# EAGLE design main_module (EAGLE 7.7.0)
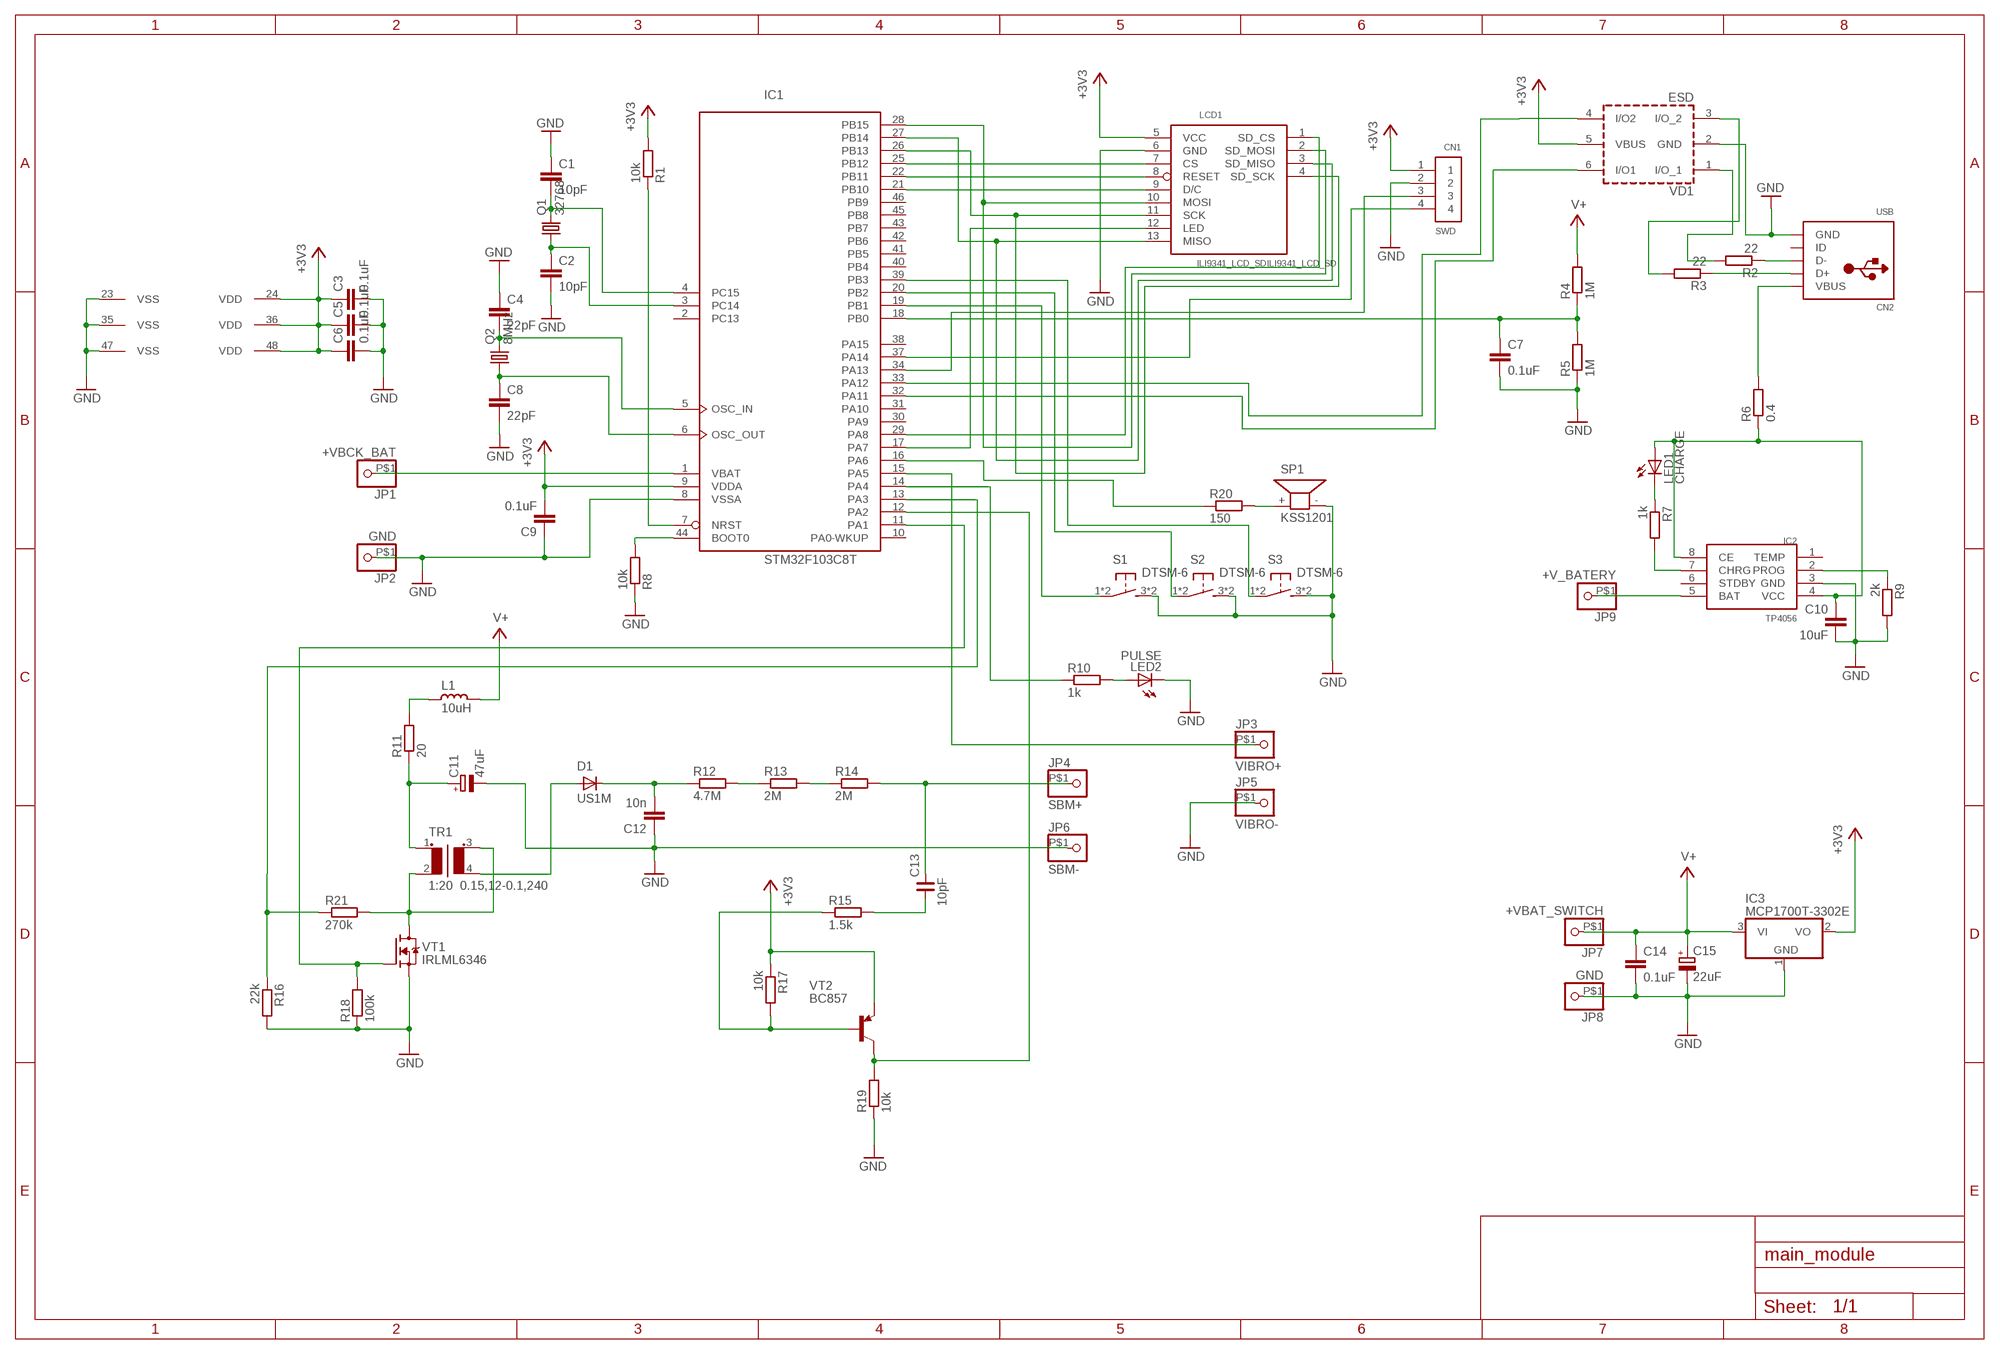
[diagram p0: schematic, sheet 1]

## Parts
C1  10pF  C-EUC0805  [C0805]
C2  10pF  C-EUC0805  [C0805]
C3  0.1uF  C-EUC0805  [C0805]
C4  22pF  C-EUC0805  [C0805]
C5  0.1uF  C-EUC0805  [C0805]
C6  0.1uF  C-EUC0805  [C0805]
C7  0.1uF  C-EUC0805  [C0805]
C8  22pF  C-EUC0805  [C0805]
C9  0.1uF  C-EUC0805  [C0805]
C10  10uF  C-EUC0805  [C0805]
C11  47uF  CPOL-EUC/6032-28R  [C/6032-28R]
C12  10n  C-EUC1206  [C1206]
C13  10pF  C_1206  [C1206]
C14  0.1uF  C-EUC0805  [C0805]
C15  22uF  CPOL-EUC/6032-28R  [C/6032-28R]
CN1  SWD  1X4-BIG  [1X04-BIG]
CN2  USB  USBMINIB  [USB-MINIB]
D1  US1M  GF1  [SMA-DO214AC]
IC1  STM32F103C8T  [LQFP48]
IC2  TP4056  [SOP-8]
IC3  MCP1700T-3302E  MCP1703CB  [SOT23]
JP1  +VBCK_BAT  PINHD-1X1-BIGPOGO  [1X1-BIGPOGO]
JP2  GND  PINHD-1X1-BIGPOGO  [1X1-BIGPOGO]
JP3  VIBRO+  PINHD-1X1-BIGPOGO  [1X1-BIGPOGO]
JP4  SBM+  PINHD-1X1-BIGPOGO  [1X1-BIGPOGO]
JP5  VIBRO-  PINHD-1X1-BIGPOGO  [1X1-BIGPOGO]
JP6  SBM-  PINHD-1X1-BIGPOGO  [1X1-BIGPOGO]
JP7  +VBAT_SWITCH  PINHD-1X1-BIGPOGO  [1X1-BIGPOGO]
JP8  GND  PINHD-1X1-BIGPOGO  [1X1-BIGPOGO]
JP9  +V_BATERY  PINHD-1X1-BIGPOGO  [1X1-BIGPOGO]
L1  10uH  L_0805  [L0805]
LCD1  ILI9341_LCD_SDILI9341_LCD_SD  [ILI9341_LCD_SD]
LED1  CHARGE  LEDCHIP-LED0805  [CHIP-LED0805]
LED2  PULSE  LED3MM  [LED3MM]
Q1  32768  CRYSTALHC49S  [HC49/S]
Q2  8MHz  CRYSTALHC49S  [HC49/S]
R1  10k  R-EU_M0805  [M0805]
R2  22  R-EU_M0805  [M0805]
R3  22  R-EU_M0805  [M0805]
R4  1M  R-EU_M0805  [M0805]
R5  1M  R-EU_M0805  [M0805]
R6  0.4  R-EU_M1206  [M1206]
R7  1k  R-EU_M0805  [M0805]
R8  10k  R-EU_M0805  [M0805]
R9  2k  R-EU_M0805  [M0805]
R10  1k  R-EU_M0805  [M0805]
R11  20  R-EU_M0805  [M0805]
R12  4.7M  R-EU_M0805  [M0805]
R13  2M  R-EU_M0805  [M0805]
R14  2M  R-EU_M0805  [M0805]
R15  1.5k  R-EU_M0805  [M0805]
R16  22k  R-EU_M0805  [M0805]
R17  10k  R-EU_M0805  [M0805]
R18  100k  R-EU_M0805  [M0805]
R19  10k  R-EU_M0805  [M0805]
R20  150  R-EU_M0805  [M0805]
R21  270k  R-EU_M0805  [M0805]
S1  DTSM-6  [DTSM-6]
S2  DTSM-6  [DTSM-6]
S3  DTSM-6  [DTSM-6]
SP1  KSS1201  [KSS1201]
TR1  1:20 0.15,12-0.1,240  RING-TRANS  [RING-TRANS]
VD1  ESD  USBLC6-2SC6  [SOT-23-6L]
VT1  IRLML6346  MOSFET-N-SOT23  [SOT23]
VT2  BC857  -PNP-SOT23-BCE  [SOT23-BCE]

## Nets
32OSC_IN: C1.2 IC1.4(PC15) Q1.2
32OSC_OUT: C2.1 IC1.3(PC14) Q1.1
+3V3 [power]: C3.1 C5.1 C6.1 C9.2 CN1.1 IC1.9(VDDA) IC1.24(VDD) IC1.36(VDD) IC1.48(VDD) IC3.2(VO) LCD1.5(VCC) R1.2 R17.1 VD1.5(VBUS) VT2.E
+V_BATTERY: IC2.5(BAT) JP9.P$1
+VBCK_BAT: IC1.1(VBAT) JP1.P$1
BATT_CTRL: C7.1 IC1.18(PB0) R4.1 R5.2
GND [power]: C1.1 C2.2 C3.2 C4.1 C5.2 C6.2 C7.2 C8.2 C9.1 C10.2 C11.- C12.1 C14.2 C15.- CN1.2 CN2.GND IC1.8(VSSA) IC1.23(VSS) IC1.35(VSS) IC1.47(VSS) IC2.3(GND) IC3.1(GND) JP2.P$1 JP5.P$1 JP6.P$1 JP8.P$1 LCD1.6(GND) LED2.K(C) R5.1 R8.1 R9.2 R16.2 R18.1 R19.1 S1.3 S1.4 S2.3 S2.4 S3.3 S3.4 SP1.- VD1.2(GND) VT1.2(S)
HV_OUT: C12.2 D1.K(C) R12.1
HV_PULSE: IC1.12(PA2) R19.2 VT2.C
HV_PUMP: IC1.11(PA1) R18.2 VT1.1(G)
HV_TEST: IC1.13(PA3) R16.1 R21.1
HV_TR_OUT: D1.A TR1.4(S2)
KEY1: IC1.19(PB1) S1.1 S1.2
KEY2: IC1.20(PB2) S2.1 S2.2
KEY3: IC1.39(PB3) S3.1 S3.2
LCD_BACKLIGHT: IC1.17(PA7) LCD1.12(LED)
LCD_CS: IC1.25(PB12) LCD1.7(CS)
LCD_RESET: IC1.22(PB11) LCD1.8(RESET)
LCD_RS: IC1.21(PB10) LCD1.9(D/C)
LED_PULSE: IC1.14(PA4) R10.1
MISO: IC1.27(PB14) LCD1.3(SD_MISO) LCD1.13(MISO)
MOSI: IC1.28(PB15) LCD1.2(SD_MOSI) LCD1.10(MOSI)
N$2: R13.2 R14.1
N$3: R20.2 SP1.+
N$6: R12.2 R13.1
N$7: IC1.7(NRST) R1.1
N$8: L1.2 R11.2
N$9: C13.1 R15.2
N$10: C10.1 IC2.4(VCC) IC2.8(CE) LED1.A R6.1
N$11: LED2.A R10.2
N$13: R15.1 R17.2 VT2.B
N$16: C11.+ R11.1 TR1.1
N$18: IC1.44(BOOT0) R8.2
N$19: CN2.D- R2.1
N$20: CN2.D+ R3.1
N$21: IC2.2(PROG) R9.1
N$22: R21.2 TR1.2 TR1.3(S1) VT1.3(D)
N$24: IC2.7(CHRG) R7.2
N$25: LED1.C R7.1
OSC_IN: C4.2 IC1.5(OSC_IN) Q2.2
OSC_OUT: C8.1 IC1.6(OSC_OUT) Q2.1
SBM+: C13.2 JP4.P$1 R14.2
SCK: IC1.26(PB13) LCD1.4(SD_SCK) LCD1.11(SCK)
SD_CS: IC1.29(PA8) LCD1.1(SD_CS)
SOUND: IC1.16(PA6) R20.1
SWCLK: CN1.4 IC1.37(PA14)
SWDIO: CN1.3 IC1.34(PA13)
USB_DM: IC1.32(PA11) VD1.6(I/O1)
USB_DM_PROT: R2.2 VD1.1(I/O_1)
USB_DP: IC1.33(PA12) VD1.4(I/O2)
USB_DP_PROT: R3.2 VD1.3(I/O_2)
USB_POWER [power]: CN2.VBUS R6.2
V+ [power]: C14.1 C15.+ IC3.3(VI) JP7.P$1 L1.1 R4.2
VIBRO: IC1.15(PA5) JP3.P$1
Unconnected: CN2.ID IC1.2(PC13) IC1.10(PA0-WKUP) IC1.30(PA9) IC1.31(PA10) IC1.38(PA15) IC1.40(PB4) IC1.41(PB5) IC1.42(PB6) IC1.43(PB7) IC1.45(PB8) IC1.46(PB9) IC2.1(TEMP) IC2.6(STDBY)

## Library data of the parts
C1-C10 C12 C14 = resistor:C-EU: CAPACITOR, European symbol
C11 C15 = resistor:CPOL-EU: POLARIZED CAPACITOR, European symbol
C13 = rc-master-smd:C_: NON-POLARIZED CAP
CN1 = adafruit:1X4: 4-pin connector
CN2 = adafruit:USB: USB Connectors USBMINIB - Surface Mount Female Mini-B USB Connector 4UConnector: 06564 By microbuilder.eu Thru-hole RA Female Mini-B USB Connector 4UConnector: 18732 By ladyada.net
D1 = diode:GF1: DIODE
IC1 = micro-stm_v3:STM32F103C*T: ARM 32-bit Cortex™-M3 CPU 72 MHz maximum frequency 16 to 128 Kbytes of Flash memory 6 to 20 kbytes of SRAM 37 GPIOs 2.0 to 3.6 V application supply
IC2 = TP4056:TP4056
IC3 = linear:MCP1703: 250 mA, 16V, Low Quiescent Current LDO Regulator Source: http://ww1.microchip.com/downloads/en/DeviceDoc/22049b.pdf
JP1-JP9 = adafruit:PINHD-1X1: Pin header 1x1 for 0.1" spacing With round pins
L1 = rc-master-smd:L_: INDUCTOR
LCD1 = ili9341:ILI9341_LCD_SD: ILI9341 2.2" LCD board with SD-Card holder
LED1 = led:LED: LED
LED2 = adafruit:LED: LED
Q1 Q2 = crystal:CRYSTAL: CRYSTAL; OC_FARNELL: 1667008; OC_NEWARK: unknown
R1-R21 = resistor:R-EU_: RESISTOR, European symbol
S1-S3 = switch-tact:DTSM-6
SP1 = buzzer:KSS1201: SPEAKER Source: Schukat; OC_FARNELL: unknown; OC_NEWARK: unknown
TR1 = transformer-pulse:RING-TRANS: TRANSFORMERS FOR DIGITAL AUDIO DATA TRANSMISSION Source: Data sheet <http://ww2.pulseeng.com/products/datasheets/T601.pdf> www.pulseeng.com
VD1 = usblc6:USBLC6-2: VERY LOW CAPACITANCE ESD PROTECTION 2 line Datasheet link <http://www.st.com/web/catalog/sense_power/FM114/CL1137/SC1489/PF93353>
VT1 = we-transistor:MOSFET-N: N-Channel MOSFET TSM3404, IRLML2502 (Vgs>=+/-20V, Vds>=20V, Id>=3A + Rds<=0.05Ohm @ Vgs=4.5V) BSS138 (Vgs>=+/-20V, Vds>=40V, Id>=0.2A + Rds<=3Ohm @ Vgs=4.5V)
VT2 = transistor:*-PNP-: PNP Transistror

## Net classes
0 default: clearance 0.152 mm
1 power: width 0.508 mm, clearance 0.152 mm to class 0, clearance 0.152 mm

## Board
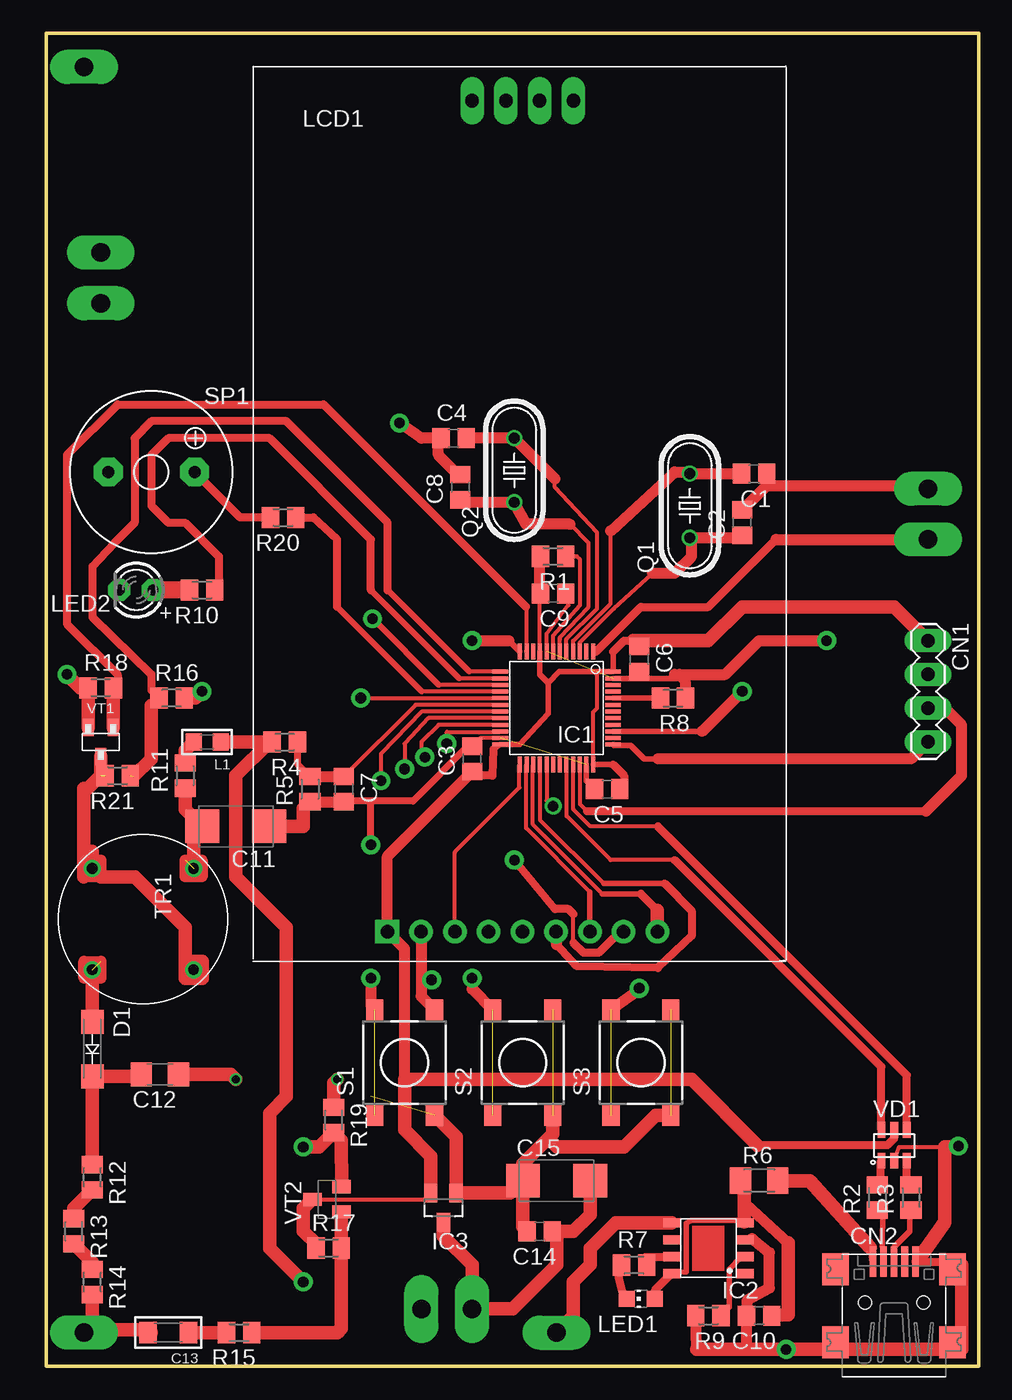
[diagram p1: board, top side]
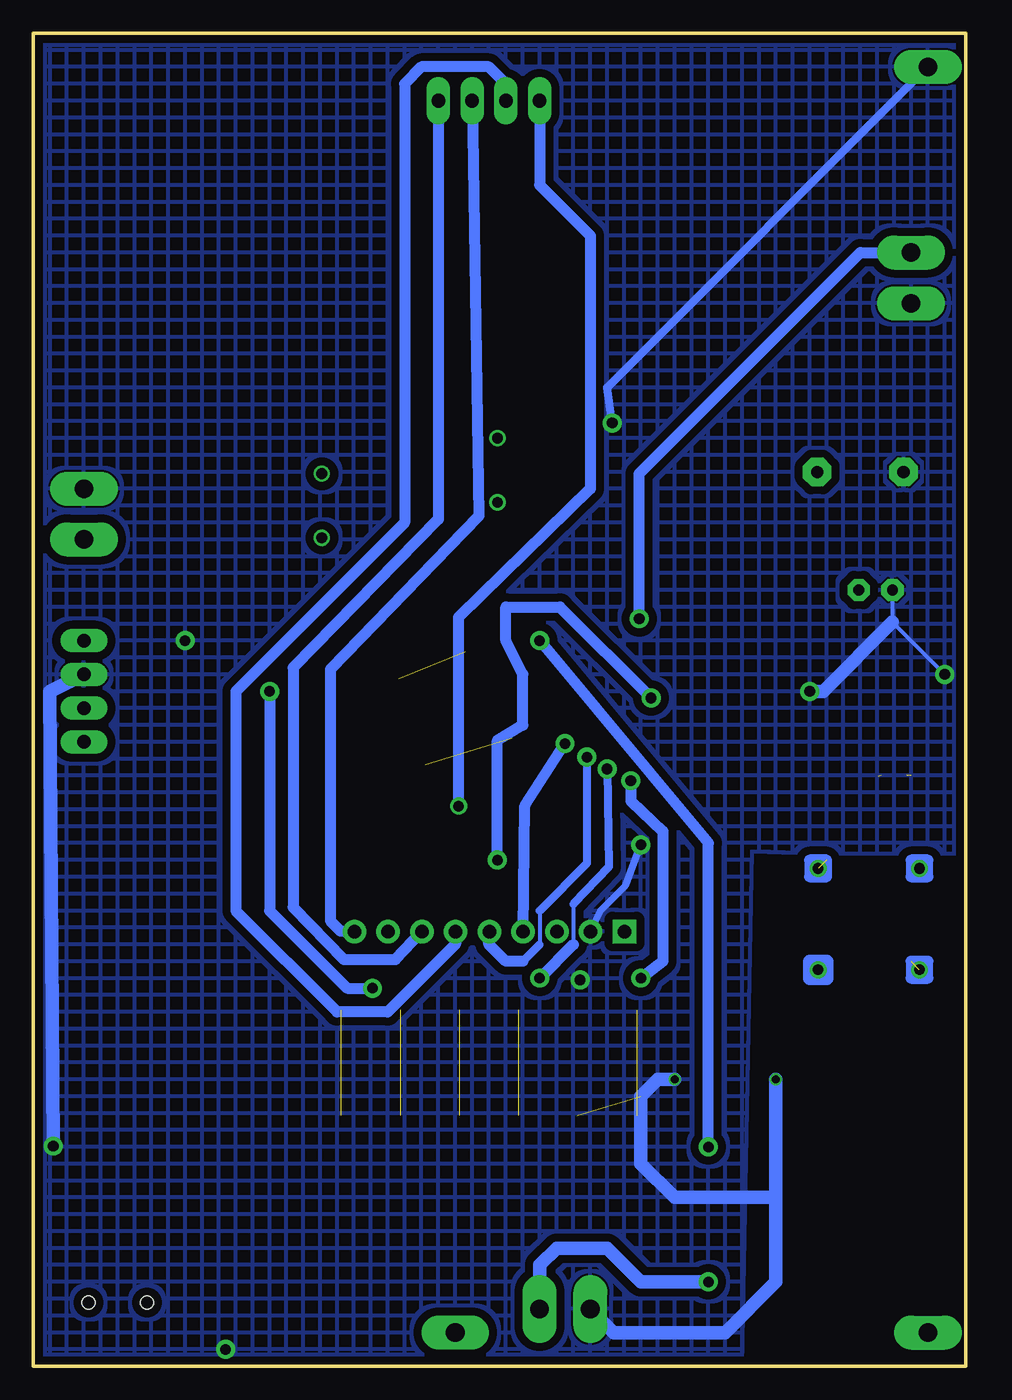
[diagram p2: board, bottom side, seen from below]

Size 70.16 x 100.31 mm. Coordinates in mm from the lower left corner, seen from the top.
Outline: 70.16,0 70.16,100.31 0,100.31 0,0 70.16,0
Copper layers (1*16): Top 0.035mm / dielectric 1.6mm / Bottom 0.035mm
Design rules "LUT *": minimum track width 6mil, minimum drill 0.5mm, track to track 6mil, track to pad 6mil, pad to pad 6mil, via to via 6mil, smd to smd 0mil, copper to edge 6mil, drill to drill 6mil, minimum pad ring 6mil, minimum via ring 6mil, stop-mask expansion 4mil, vias tented up to drill 0mil, thermal gap 6mil

### Footprints (pad centres in the part's own frame; a part is rotated, then mirrored left to right if it is on the bottom)
C0805 = smd 1.3 x 1.5: 1 -0.95,0; 2 0.95,0
C/6032-28R = smd 2.55 x 2.5: + 2.525,0; - -2.525,0
C1206 = smd 1.6 x 1.8: 1 -1.4,0; 2 1.4,0
C1206' = smd 1.3 x 1.6: 1 -1.524,0; 2 1.524,0
1X04-BIG = drill 1.016 pad 1.778 long: 1 0,0; 2 2.54,0; 3 5.08,0; 4 7.62,0
USB-MINIB = smd 0.5 x 2.308: D+ 0,4.064; D- -0.8,4.064; GND 1.6,4.064; ID 0.8,4.064; VBUS -1.6,4.064 | smd 2 x 2.4: GND1 -4.4,-2; GND2 -4.4,3.5; GND3 4.4,3.5; GND4 4.4,-2 | hole 1: -2.2,1; 2.2,1
SMA-DO214AC = smd 1.8 x 1.7: A -2.05,0; K 2.05,0
LQFP48 = smd 0.3 x 1.2: 1 -2.75,-4.25; 2 -2.25,-4.25; 3 -1.75,-4.25; 4 -1.25,-4.25; 5 -0.75,-4.25; 6 -0.25,-4.25; 7 0.25,-4.25; 8 0.75,-4.25; 9 1.25,-4.25; 10 1.75,-4.25; 11 2.25,-4.25; 12 2.75,-4.25; 25 2.75,4.25; 26 2.25,4.25; 27 1.75,4.25; 28 1.25,4.25; 29 0.75,4.25; 30 0.25,4.25; 31 -0.25,4.25; 32 -0.75,4.25; 33 -1.25,4.25; 34 -1.75,4.25; 35 -2.25,4.25; 36 -2.75,4.25 | smd 1.2 x 0.3: 13 4.25,-2.75; 14 4.25,-2.25; 15 4.25,-1.75; 16 4.25,-1.25; 17 4.25,-0.75; 18 4.25,-0.25; 19 4.25,0.25; 20 4.25,0.75; 21 4.25,1.25; 22 4.25,1.75; 23 4.25,2.25; 24 4.25,2.75; 37 -4.25,2.75; 38 -4.25,2.25; 39 -4.25,1.75; 40 -4.25,1.25; 41 -4.25,0.75; 42 -4.25,0.25; 43 -4.25,-0.25; 44 -4.25,-0.75; 45 -4.25,-1.25; 46 -4.25,-1.75; 47 -4.25,-2.25; 48 -4.25,-2.75
SOP-8 = smd 1.3 x 0.7: 1 -2.75,1.905; 2 -2.75,0.635; 3 -2.75,-0.635; 4 -2.75,-1.905; 5 2.75,-1.905; 6 2.75,-0.635; 7 2.75,0.635; 8 2.75,1.905
SOT23 = smd 1 x 1.4: 1 -0.95,-1.1; 2 0.95,-1.1; 3 0,1.1
1X1-BIGPOGO = drill 1.4 pad 2.54 long: P$1 0,0
L0805 = smd 1.2 x 1.3: 1 -1.016,0; 2 1.016,0
ILI9341_LCD_SD = drill 1.016 pad 1.778 long: 1 1.27,1.27; 2 3.81,1.27; 3 6.35,1.27; 4 8.89,1.27 | drill 1.016 pad 1.778 square: 5 -5.11,-61.26 | drill 1.016 pad 1.778: 6 -2.57,-61.26; 7 -0.03,-61.26; 8 2.51,-61.26; 9 5.05,-61.26; 10 7.59,-61.26; 11 10.13,-61.26; 12 12.67,-61.26; 13 15.21,-61.26
CHIP-LED0805 = smd 1.2 x 1.2: A 0,-1.05; C 0,1.05
LED3MM = drill 0.813 pad 1.676 octagon: A -1.27,0; K 1.27,0
HC49/S = drill 0.813: 1 -2.413,0; 2 2.413,0
M0805 = smd 1.3 x 1.6: 1 -0.95,0; 2 0.95,0
M1206 = smd 1.6 x 2: 1 -1.4,0; 2 1.4,0
DTSM-6 = smd 1.55 x 1.3: 1 -3.975,2.25; 2 3.975,2.25; 3 -3.975,-2.25; 4 3.975,-2.25
KSS1201 = drill 0.914 pad 2.159 octagon: + 3.251,0; - -3.251,0
RING-TRANS = drill 0.8 pad 1.27: 1 -3.81,3.81; 2 -3.81,-3.81; 3 3.81,3.81; 4 3.81,-3.81
SOT-23-6L = smd 0.6 x 1.2: 1 -0.95,-2.3; 2 0,-2.3; 3 0.95,-2.3; 4 0.95,0; 5 0,0; 6 -0.95,0
SOT23' = smd 1.3 x 0.9: 1 -1.1,0.95; 2 -1.1,-0.95; 3 1.1,0
SOT23-BCE = smd 1 x 1.4: B -0.95,-1.1; C 0.95,-1.1; E 0,1.1

### Placement (x,y rotation side)
C1  53.26,67.18 180 top
C2  52.38,63.5 90 top
C3  32.05,45.72 90 top
C4  30.66,69.85 0 top
C5  42.21,43.43 180 top
C6  44.63,53.21 270 top
C7  22.4,43.43 270 top
C8  31.17,66.17 90 top
C9  38.15,58.17 180 top
C10  53.64,3.81 180 top
C11  14.28,40.64 180 top
C12  8.56,21.97 180 top
C13  10pF  [C1206']  9.2,2.54 180 top
C14  37.13,10.16 180 top
C15  38.4,13.97 0 top
CN1  66.34,54.61 270 top
CN2  63.8,3.81 0 top
D1  3.48,23.88 270 top
IC1  38.4,49.53 180 top
IC2  49.83,8.89 180 top
IC3  29.9,11.94 180 top
JP1  66.34,62.23 180 top
JP2  66.34,66.04 180 top
JP3  4.12,83.82 180 top
JP4  2.85,2.54 180 top
JP5  4.12,80.01 180 top
JP6  2.85,97.79 180 top
JP7  32.05,4.32 90 top
JP8  28.25,4.32 90 top
JP9  38.4,2.54 0 top
L1  12.12,46.99 180 top
LCD1  30.79,93.98 0 top
LED1  44.75,5.08 90 top
LED2  6.78,58.42 180 top
Q1  48.44,64.77 90 top
Q2  35.23,67.44 90 top
R1  38.15,60.96 180 top
R2  62.53,12.7 90 top
R3  65.08,12.7 90 top
R4  17.96,46.99 180 top
R5  19.86,43.43 90 top
R6  53.64,13.97 0 top
R7  44.25,7.62 0 top
R8  47.17,50.29 180 top
R9  49.83,3.81 180 top
R10  11.73,58.42 180 top
R11  10.46,44.45 90 top
R12  3.48,14.22 270 top
R13  2.08,10.16 270 top
R14  3.48,6.35 270 top
R15  14.53,2.54 180 top
R16  9.45,50.29 0 top
R17  21.26,8.89 0 top
R18  4.12,51.05 0 top
R19  21.64,18.54 270 top
R20  17.83,63.88 180 top
R21  5.38,44.45 180 top
S1  26.98,22.86 90 top
S2  35.86,22.86 90 top
S3  44.75,22.86 90 top
SP1  7.93,67.31 0 top
TR1  7.29,33.66 270 top
VD1  63.8,17.78 0 top
VT1  IRLML6346  [SOT23']  4.12,46.99 270 top
VT2  21.13,12.57 90 top

### Tracks (layer width: path | path; a pad name or v marks a point on that pad's centre or on a via)
32OSC_IN
  Top 0.305: IC1.4 39.65,54.59 42.47,57.4 42.47,62.87 | 48.31,67.31 Q1.2
  Top 0.813: 42.47,62.87 47.29,67.31 48.31,67.31 | Q1.2 C1.2
32OSC_OUT
  Top 0.305: IC1.3 40.15,54.45 42.72,57.02 45.64,59.69 | 48.56,62.23 Q1.1
  Top 0.61: 52.18,62.36 C2.1
  Top 0.813: 45.64,59.69 47.29,59.69 48.56,60.96 48.56,62.23 | Q1.1 52.18,62.36
+3V3
  Top 0.305: 32.38,44.45 C3.1 | 43.48,43.75 C5.1 | 44.18,54.61 C6.1 | C9.2 37.15,57.87 IC1.9 37.13,53.76 | 37.15,60.66 R1.2 | VD1.5 63.8,17.14 | IC1.36 41.15,49.23 41.45,49.53 41.45,52.03 41.2,52.28 | VT2.E 28.48,12.57 IC3.2
  Top 0.406: 33.65,46.42 IC1.24 35.65,46.78 37.77,49.15 37.77,51.44 | IC1.36 42.65,45.28 | 42.65,53.78 IC1.48 41.2,52.28 38.61,52.28 37.77,51.44 | 37.77,51.44 37.13,52.07 37.13,53.76
  Top 0.61: 33.65,46.42 33.58,44.45 32.38,44.45 | 42.65,45.28 43.48,44.45 43.48,43.75 | 42.65,53.78 43.48,54.61 44.18,54.61 | 63.8,17.14 63.3,16.64 53.52,16.64
  Top 0.813: C3.1 25.68,38.39 LCD1.5 26.98,31.42 26.98,21.59 | 37.15,57.87 37.15,60.66
  Top 1.016: 53.52,16.64 48.56,21.59 26.98,21.59 26.98,17.78 28.95,15.81 IC3.2 | 44.18,54.61 49.83,54.61 52.38,57.15 63.8,57.15 CN1.1 | R17.1 20.31,9.21 19.36,10.16 19.36,11.89 VT2.E
+V_BATTERY
  Top 1.016: IC2.5 42.85,10.79 40.94,8.89 40.94,7.62 39.67,6.35 39.67,3.81 JP9.P$1
+VBCK_BAT
  Top 0.305: IC1.1 41.38,53.78
  Top 0.61: 41.38,53.78 44.75,57.15 49.83,57.15 54.91,62.23
  Top 0.813: 54.91,62.23 JP1.P$1
BATT_CTRL
  Top 0.305: IC1.18 27.8,49.78 C7.1
  Top 0.508: R4.1 18.91,45.34 R5.2
  Top 0.813: R5.2 C7.1
GND  (via drill 0.6, 0.8 pad 1.42)  (5 unrouted)
  Top 0.305: IC1.23 32.66,47.28 C3.2 | 40.65,44.04 C5.2 | IC1.47 44.14,51.78 C6.2 | IC1.8 37.65,55.13 39.29,57.28 39.29,57.85 C9.1 | VD1.2 64.19,16.51 67.63,16.51 | 35.86,13.98 C15.-
  Top 0.406: IC1.35 40.65,44.04 | IC1.47 47.93,51.78 48.12,51.46
  Top 0.508: 53.1,9.61 52.64,9.49 IC2.3 | 52.76,3.89 C10.2 | 48.98,3.43 48.98,3.77 R9.2 | 52.76,3.66 C10.2 | 65.7,8.14 CN2.GND | 52.87,3.43 C10.2 | 52.69,1.59 52.38,1.27 | 19.36,41.98 R5.1 | C3.2 31.74,46.67 27.61,42.55 24.43,42.55 | 24.43,42.55 22.46,42.55 C7.2 | 68.63,7.87 68.88,7.62 | v24.43,39.24 24.43,42.55
  Top 0.61: CN2.GND 68.63,7.87 | C4.1 29.52,69.66 29.52,69.85 | C8.2 30.98,67.12 | C1.1 54.21,66.29 | 66.1,66.29 JP2.P$1
  Top 0.813: 53.1,9.61 54.42,8.55 54.42,5.91 52.76,5 52.76,3.89 | C10.2 52.69,1.59 | R9.2 48.88,2.22 48.95,1.27 | R5.1 C7.2 | R8.1 48.12,51.46 | LCD1.6 28.21,27.84 S1.4 | 29.52,69.66 29.52,68.58 30.98,67.12 | 29.52,69.85 28.25,69.85 v26.59,70.99 | C2.2 54.21,66.29 66.1,66.29 | 47.64,52.07 51.1,52.07 53.64,54.61 v58.72,54.61 | 47.29,52.07 47.64,52.07 | 47.64,52.07 47.93,51.78
  Top 1.016: v68.64,16.57 67.63,16.51 67.63,10.83 65.7,8.14 | 48.95,1.27 52.38,1.27 v55.68,1.27 68.88,1.27 68.88,7.62 | C11.- 19.36,40.64 19.36,41.98 | S2.3 38.11,17.49 37.77,17.14 | 37.77,17.14 35.86,15.24 35.86,13.98 C15.- | S3.3 45.86,18.89 43.48,16.51 38.4,16.51 37.77,17.14 | C15.- 35.86,10.48 C14.2 | v1.58,52.07 2.59,51.05 R18.1 VT1.2 | R16.2 11.23,50.29 v11.73,50.8 | C15.- 34.93,13.04 IC3.1 30.85,17.26 S1.3 | C12.1 13.89,21.97 v14.28,21.59 | R19.1 21.64,21.34 v21.89,21.59
  Bottom 0.305: LED2.K 5.51,56.01 v1.58,52.07
  Bottom 0.508: LCD1.6 27.45,34.32 25.58,36.2 v24.43,39.24
  Bottom 0.61: v26.59,70.99 26.98,73.66 JP6.P$1
  Bottom 1.016: v11.73,50.8 10.72,50.8 5.51,56.01 | v68.64,16.57 68.9,50.79 CN1.2 | v14.28,21.59 14.28,12.7 | 14.28,12.7 14.28,6.35 18.09,2.54 26.47,2.54 JP8.P$1 | v21.89,21.59 23.16,21.59 24.43,20.32 24.43,15.24 21.89,12.7 14.28,12.7
  other vias: 29.01,29.08
  pour Bottom (isolate 0.61, hatched): 0.18,100.33 70.16,100.33 70.16,0 16.82,0 16.05,38.73 11.61,38.61 0.56,38.61
HV_OUT
  Top 1.016: R12.1 D1.K 7.02,21.83 C12.2
HV_PULSE  (via drill 0.8 pad 1.42)
  Top 0.406: 34.82,54.61 IC1.12
  Top 0.813: v32.05,54.61 34.82,54.61
  Top 1.016: v19.36,16.51 20.56,16.51 R19.2 22.21,17.02 VT2.C
  Bottom 0.813: v19.36,16.51 19.36,39.37 v32.05,54.61
HV_PUMP
  Top 0.305: 36.12,57.15 36.12,53.82 IC1.11 | 5.38,51.37 R18.2
  Top 0.61: 36.12,57.15 20.88,72.39 5.38,72.39 1.58,68.58 1.58,55.88 5.38,52.07 5.38,51.37
  Top 1.016: R18.2 VT1.1
HV_TEST  (1 unrouted)
  Top 0.305: 7.93,49.72 R16.1 7.93,50.87 | IC1.13 31.85,52.28
  Top 0.406: 31.85,52.28 25.71,58.42
  Top 0.61: 25.71,58.42 25.71,63.5 18.09,71.12 7.93,71.12 6.66,69.85 6.66,63.5 5.13,61.98 3.48,60.2 3.48,56.39 7.93,52.07 7.93,50.87
  Top 1.016: 6.58,44.37 7.93,45.72 7.93,49.72
HV_TR_OUT  (2 unrouted)
  Top 0.813: 2.85,29.21 2.85,30.48 4.12,30.48 4.12,29.21 2.85,29.21
  Top 1.016: D1.A TR1.4
  Bottom 0.813: 2.85,29.21 2.85,30.48 4.12,30.48 4.12,29.21 2.85,29.21
KEY1  (via drill 0.8 pad 1.42)  (1 unrouted)
  Top 0.305: IC1.19 28.25,49.28 25.2,46.1 v25.2,44.07 | 24.43,27.12 S1.2
  Top 0.813: v24.43,29.21 24.43,27.12
  Bottom 0.813: v25.2,44.07 25.2,42.55 22.78,40.26 22.78,30.48 v24.43,29.21
KEY2  (via drill 0.8 pad 1.42)  (1 unrouted)
  Top 0.305: IC1.20 28.77,48.78 26.98,46.86 v26.98,44.96
  Top 0.813: v32.05,29.21 32.05,28.39 S2.2
  Bottom 0.305: 29.52,34.8 29.52,31.75
  Bottom 0.61: v26.98,44.96 26.85,37.59 29.52,34.8
  Bottom 0.813: 29.52,31.75 v32.05,29.21
KEY3  (via drill 0.8 pad 1.42)  (1 unrouted)
  Top 0.305: v44.63,28.45 44.63,28.32
  Top 0.406: IC1.39 49.35,47.78
  Top 0.813: 49.35,47.78 v52.38,50.8 | 44.63,28.32 S3.2
  Bottom 0.813: v52.38,50.8 52.38,34.29 46.53,28.45 v44.63,28.45
LCD_BACKLIGHT  (via drill 0.8 pad 1.42)
  Top 0.305: LCD1.12 43.18,32.72 | 39.67,31.88 39.67,34.04 | v23.67,50.29 34.14,50.29 IC1.17
  Top 0.61: 43.18,32.72 41.58,31.11 40.44,31.11 39.67,31.88 | 39.67,34.04 39.29,34.42 38.28,34.42 v35.23,38.1
  Bottom 0.813: v35.23,38.1 35.23,47.12 33.32,48.26 33.32,52.07 34.59,54.61 34.59,57.15 30.53,57.15 v23.67,50.29
LCD_CS
  Top 0.305: LCD1.7 30.75,38.7 35.61,43.56 35.61,45.24 IC1.25
LCD_RESET  (via drill 0.8 pad 1.42)
  Top 0.305: v30.15,46.86 30.15,47.75 34.13,47.75 IC1.22
  Bottom 0.813: v30.15,46.86 33.17,42.19 LCD1.8
LCD_RS  (via drill 0.8 pad 1.42)
  Top 0.305: IC1.21 29.54,48.28 28.25,46.99 28.25,46.1 v28.5,45.85
  Bottom 0.305: 32.05,34.29 32.05,31.75 | 35.86,32.69 LCD1.9
  Bottom 0.61: v28.5,45.85 28.5,37.85 32.05,34.29 | 32.05,31.75 33.32,30.48
  Bottom 0.813: 33.32,30.48 34.59,30.48 35.86,31.75 35.86,32.69
LED_PULSE
  Top 0.305: IC1.14 31.07,51.78 | 13.01,58.74 R10.1
  Top 0.406: 31.07,51.78 24.43,58.42
  Top 0.61: 24.43,58.42 24.43,62.23 16.82,69.85 9.2,69.85 7.93,68.58 7.93,64.77 9.2,63.5 10.46,63.5 13.01,60.96 13.01,58.74
MISO
  Top 0.305: 41.83,35.56 36.63,40.77 36.63,45.25 IC1.27
  Top 0.406: 44.75,35.56 41.83,35.56
  Top 0.61: 45.99,34.32 44.75,35.56
  Top 1.016: LCD1.13 45.99,34.32
  Bottom 0.305: 46.04,32.77 LCD1.13
  Bottom 0.813: LCD1.3 36.63,64.01 47.8,52.45 47.8,33.53 47.04,32.77 46.04,32.77
MOSI
  Top 0.305: IC1.28 37.15,41.13 41.96,36.32 | 38.4,32.69 LCD1.10
  Top 0.406: 41.96,36.32 46.53,36.32
  Top 0.61: 46.53,36.32 48.56,34.29 48.56,32.38 46.02,29.97 39.93,30.1 38.4,31.75
  Top 0.813: 38.4,31.75 38.4,32.69
  Bottom 0.813: LCD1.10 38.38,31.78 43.48,26.67 47.29,26.67 54.91,34.29 54.91,50.8 42.21,63.5 42.21,96.52 40.94,97.79 35.86,97.79 34.59,96.52 LCD1.2
N$1
  Bottom 1.016: 10.46,30.48 11.73,30.48 11.73,29.21 10.46,29.21 10.46,30.48
N$2
  Top 1.016: R14.1 3.48,7.81 R13.2
N$3
  Top 0.61: R20.2 14.61,63.88 SP1.+
N$6
  Top 1.016: R13.1 2.08,11.88 R12.2
N$7
  Top 0.305: IC1.7 38.15,54.99 40.18,57.28 40.18,60.71 39.93,60.96 R1.1
N$8
  Top 1.016: R11.2 10.46,46.35 L1.2
N$9
  Top 1.016: R15.2 C13.1
N$10
  Top 0.254: 52.53,13.72 52.3,13.95 R6.1 | 52.53,10.86 IC2.4 | 52.64,12.24 IC2.4 | 47.38,7.09 47.15,7.09 IC2.8 | 52.41,10.97 IC2.4
  Top 0.305: LED1.A 45.8,5.71
  Top 0.406: 47.38,7.09 48.17,7.11 48.17,10.74 48.53,10.97 52.41,10.97
  Top 0.61: 45.8,5.71 IC2.8
  Top 0.813: 52.64,12.24 55.85,9.28
  Top 1.016: 52.53,13.72 52.53,10.86 | 55.85,9.28 55.85,3.89 C10.1
N$11
  Top 1.27: R10.2 LED2.A
N$13
  Top 1.016: R15.1 21.89,2.54 22.21,2.85 R17.2 22.21,11.6 VT2.B
N$16  (2 unrouted)
  Top 0.254: 10.46,43.43 R11.1
  Top 0.305: 11.1,39.99 C11.+
  Top 0.508: C11.+
  Top 0.813: 10.46,38.1 11.73,38.1 11.73,36.83 10.46,36.83 10.46,38.1
  Top 1.016: 10.88,41.49 C11.+ | 10.46,43.43 10.46,41.92 C11.+ | TR1.1 11.1,39.99
  Bottom 0.813: 10.46,38.1 11.73,38.1 11.73,36.83 10.46,36.83 10.46,38.1
N$18
  Top 0.305: 46.59,50.28 R8.2
  Top 0.406: IC1.44 46.59,50.28
N$19
  Top 0.254: 62.97,11.66 62.59,11.66 R2.1 | 62.93,9.03 62.93,7.89 CN2.D-
  Top 0.406: 62.93,9.03 62.97,11.66
N$20
  Top 0.254: 63.84,9.03 63.84,7.89 CN2.D+ | 64.99,11.66 R3.1
  Top 0.406: 64.99,11.66 64.99,10.17 63.84,9.03
N$21
  Top 0.254: 52.3,8.23 52.53,8.23 IC2.2 | 51.38,4.46 50.81,3.89 R9.1
  Top 0.406: 52.3,8.23 51.38,7.32 51.38,4.46
N$22  (2 unrouted)
  Top 0.813: 2.85,38.1 4.12,38.1 4.12,36.83 2.85,36.83 2.85,38.1
  Top 1.016: TR1.2 3.48,38.73 2.85,36.83 2.85,42.88 2.85,43.18 | 2.85,43.18 2.85,43.48 | VT1.3 4.12,44.45 2.85,43.18 | 4.12,36.83 6.66,36.83 10.46,33.02 10.46,30.48 | 10.46,30.48 TR1.3 | 10.46,30.48 11.73,30.48 11.73,29.21 10.46,29.21 10.46,30.48
  Bottom 0.813: 2.85,38.1 4.12,38.1 4.12,36.83 2.85,36.83 2.85,38.1
N$24
  Top 0.254: 45.1,8.23 45.16,7.91 R7.2 | 47.04,8.23 IC2.7
  Top 0.61: 45.1,8.23 47.04,8.23
N$25
  Top 0.305: LED1.C 43.48,5.08 | 43.1,7.55 R7.1
  Top 0.61: 43.48,5.08 43.1,6.73 43.1,7.55
OSC_IN
  Top 0.305: IC1.5 39.15,54.73 41.45,57.02 41.45,62.74 38.28,66.17 38.28,66.8
  Top 0.813: 38.28,66.8 Q2.2 C4.2
OSC_OUT
  Top 0.305: IC1.6 38.65,54.73 38.66,54.74 38.66,54.86 40.82,57.15 40.82,61.98 39.42,63.37
  Top 0.61: 31.36,65.02 C8.1
  Top 0.813: 39.42,63.37 36.12,63.37 Q2.1 31.36,65.02
SBM+
  Top 0.254: C13.2 7.61,2.63 2.92,2.63 JP4.P$1 3.38,2.74
  Top 1.016: 7.93,2.54 7.72,2.74 3.38,2.74 3.48,2.85 R14.2
SCK
  Top 0.305: 40.91,35.72 36.12,40.51 36.12,45.24 IC1.26
  Top 0.406: LCD1.11 40.91,35.72
  Bottom 0.813: LCD1.4 39.67,63.75 50.6,52.58 50.6,34.54 46.79,30.61 42.9,30.61 LCD1.11
SD_CS  (via drill 0.8 pad 1.27)
  Top 0.305: IC1.29 37.65,42.56 v38.15,42.16
  Bottom 0.813: LCD1.1 32.05,88.9 28.25,85.09 28.25,66.04 38.15,56.39 v38.15,42.16
SOUND
  Top 0.305: IC1.16 28.27,50.78
  Top 0.406: 28.27,50.78 21.89,57.15
  Top 0.61: 21.89,57.15 21.89,62.23 20.12,63.88 19.36,63.88 R20.1
SWCLK
  Top 0.305: 66.13,46.78 CN1.4
  Top 0.406: 46.02,45.72 45.01,45.72 43.99,46.74 42.7,46.74 IC1.37
  Top 0.813: 66.13,46.78 65.08,45.72 46.02,45.72
SWDIO
  Top 0.305: IC1.34 40.15,42.32 40.69,41.78
  Top 0.61: 40.69,41.78 66.22,41.78
  Top 0.813: 66.22,41.78 68.88,44.45 68.88,48.26 67.61,49.53 CN1.3
USB_DM
  Top 0.305: 47.29,38.1 42.47,38.1 39.17,41.4 39.17,45.27 IC1.32
  Top 0.61: VD1.6 62.85,22.54 47.29,38.1
USB_DM_PROT
  Top 0.254: 62.81,13.95 62.59,13.72 R2.2 | 62.81,15.43 VD1.1
  Top 0.61: 62.81,13.95 62.81,15.43
USB_DP
  Top 0.305: 46.02,40.64 40.94,40.64 39.67,41.91 39.67,45.26 IC1.33
  Top 0.61: VD1.4 64.75,21.91 46.02,40.64
USB_DP_PROT
  Top 0.254: 64.76,13.95 64.99,13.72 R3.2 | 64.76,15.43 VD1.3
  Top 0.61: 64.76,13.95 64.76,15.43
USB_POWER
  Top 0.508: 55.16,13.95 R6.2 | 62,8.9 CN2.VBUS
  Top 1.016: 55.16,13.95 57.47,13.95 62,8.9
V+  (via drill 0.8 pad 1.42)
  Top 0.305: 38.4,9.84 C14.1
  Top 0.406: R4.2 16.82,46.99
  Top 0.508: 32.07,4.34 JP7.P$1
  Top 0.813: 40.28,10.79 40.93,11.41
  Top 1.016: R4.2 L1.1 | C15.+ 40.93,11.41 39.67,10.16 C14.1 | 32.07,4.34 35.13,4.34 38.4,7.62 38.4,9.84 | 16.82,46.99 14.28,44.45 14.28,36.83 18.09,33.02 18.09,20.32 16.82,19.05 16.82,8.89 v19.36,6.35 | IC3.3 29.9,9.78 32.05,7.62 JP7.P$1
  Bottom 0.508: 31.95,4.34 JP7.P$1
  Bottom 1.016: v19.36,6.35 24.43,6.35 26.98,8.89 30.79,8.89 32.05,7.62 JP7.P$1
VIBRO  (via drill 0.8 pad 1.42)
  Top 0.305: IC1.15 29.54,51.28
  Top 0.406: 29.54,51.28 v24.56,56.26
  Bottom 0.813: v24.56,56.26 24.56,67.18 7.93,83.82 JP3.P$1